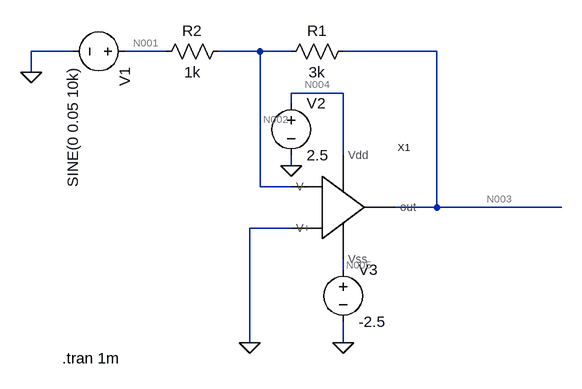
[diagram p0: schematic 2b.asc]
2b.asc, the LTspice schematic file:
Version 4
SHEET 1 880 680
WIRE -368 -176 -432 -176
WIRE -224 -176 -288 -176
WIRE -80 -176 -144 -176
WIRE -32 -176 -80 -176
WIRE 192 -176 48 -176
WIRE -432 -144 -432 -176
WIRE 48 -112 -32 -112
WIRE -32 -96 -32 -112
WIRE 48 -16 48 -112
WIRE -32 0 -32 -16
WIRE -80 32 -80 -176
WIRE -32 32 -80 32
WIRE 192 64 192 -176
WIRE 192 64 128 64
WIRE 384 64 192 64
WIRE -32 96 -96 96
WIRE 48 160 48 144
WIRE -96 272 -96 96
WIRE 48 272 48 240
FLAG -96 272 0
FLAG 48 272 0
FLAG -32 0 0
FLAG -432 -144 0
SYMBOL res 64 -192 R90
WINDOW 0 0 56 VBottom 2
WINDOW 3 32 56 VTop 2
SYMATTR InstName R1
SYMATTR Value 3k
SYMBOL voltage -272 -176 R90
WINDOW 123 24 44 Left 2
WINDOW 39 0 0 Left 0
SYMATTR InstName V1
SYMATTR Value SINE(0 0.05 10k)
SYMBOL voltage -32 -112 R0
WINDOW 123 0 0 Left 0
WINDOW 39 0 0 Left 0
SYMATTR InstName V2
SYMATTR Value 2.5
SYMBOL voltage 48 144 R0
WINDOW 123 0 0 Left 0
WINDOW 39 0 0 Left 0
SYMATTR InstName V3
SYMATTR Value -2.5
SYMBOL res -128 -192 R90
WINDOW 0 0 56 VBottom 2
WINDOW 3 32 56 VTop 2
SYMATTR InstName R2
SYMATTR Value 1k
SYMBOL OPAMP -64 64 R0
SYMATTR InstName X1
TEXT -384 296 Left 2 !.tran 1m

The netlist it stands for:
* 2b.asc
R1 N003 N002 3k
V1 N001 0 SINE(0 0.05 10k)
V2 N004 0 2.5
V3 N005 0 -2.5
R2 N002 N001 1k
XX1 N004 N005 N002 0 N003 OPAMP  ; pins Vdd Vss V- V+ out
.tran 1m
.backanno
.end

* Results of the author's LTspice run, read from the files saved beside the schematic
* Operating Point, zero values left out:
*   V(n003) = 190.3 µV
*   V(n002) = 47.58 µV
*   V(n004) = 2.5 V
*   V(n005) = -2.5 V
*   I(R1) = 47.58 nA
*   I(R2) = 47.58 nA
*   I(V1) = 47.58 nA
*   I(V2) = -188.5 µA
*   I(V3) = 188.4 µA
*   Ix(x1:VDD) = 188.5 µA
*   Ix(x1:VSS) = -188.4 µA
*   Ix(x1:OUT) = -47.58 nA
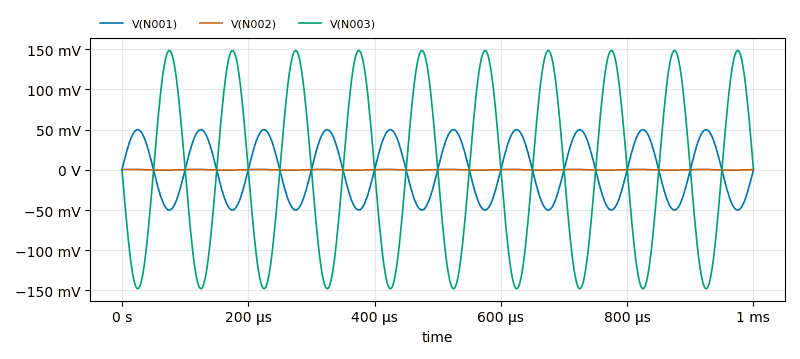
[diagram p1: Transient Analysis of 2b.asc, plotted from the saved traces]
* Transient Analysis, 1 run:
*   V(N001): min -50 mV, max 50 mV, average -34.78 nV, rms 35.36 mV, last 0 V
*   V(N002): min -402.7 µV, max 557.7 µV, average 66.02 µV, rms 345.3 µV, last 323.1 µV
*   V(N003): min -147.9 mV, max 148.6 mV, average 264.2 µV, rms 104.9 mV, last 1.292 mV